# Altium schematic sheet Sheet.schdoc
size 307 x 221 mm
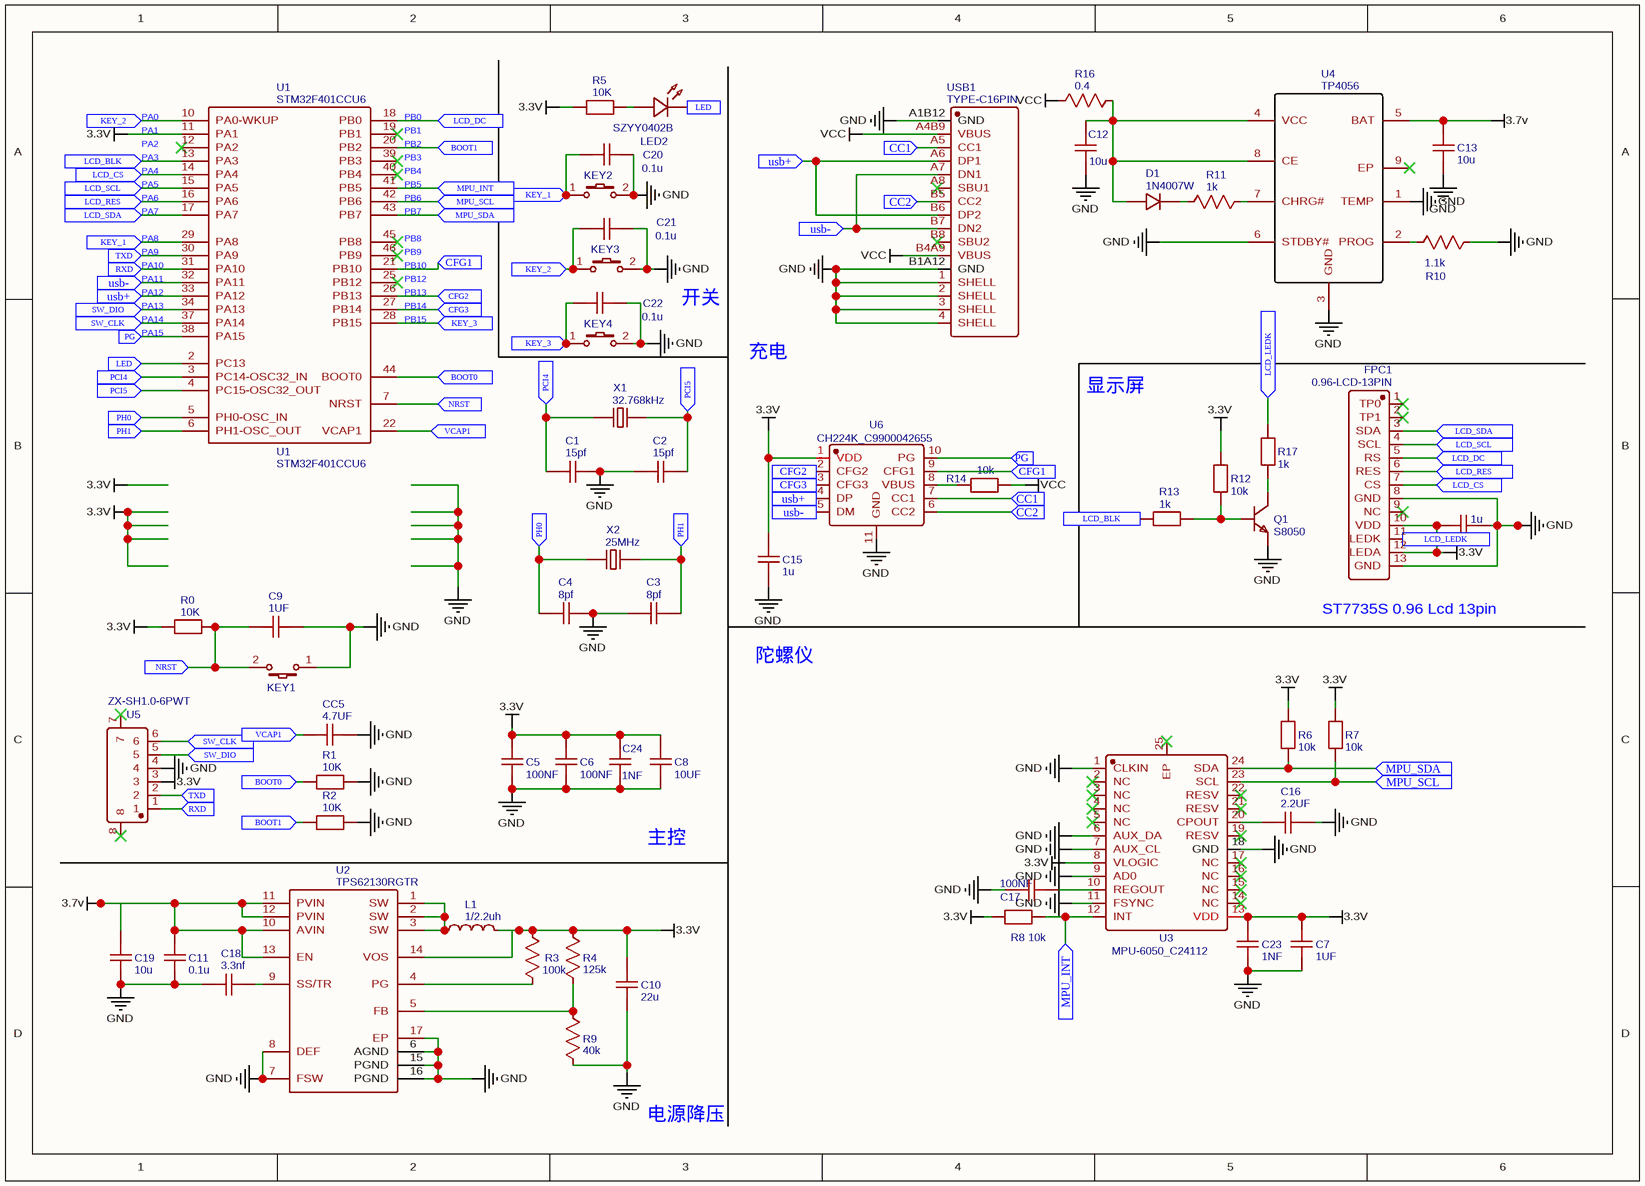
[diagram p0: Sheet.schdoc]

## Parts
(Parts that share a designator on the sheet are numbered #1, #2 ... from top to bottom, then left to right.)
C1  15pf  [C0402]
C2  15pf  [C0402]
C3  8pf  [C0402]
C4  8pf  [C0402]
C5  100NF  [C0402]
C6  100NF  [C0402]
C7  1UF  [C0402]
C8  10UF  [C0402]
C9  1UF  [C0402]
C10  22u  [C0402]
C11  0.1u  [C0402]
C12  10u  [C0402]
C13  10u  [C0402]
C14  1u  [C0402]
C15  1u  [C0402]
C16  2.2UF  [C0603]
C17  100NF  [C0603]
C18  3.3nf  [C0402]
C19  10u  [C0402]
C20  0.1u  [C0603]
C21  0.1u  [C0603]
C22  0.1u  [C0603]
C23  1NF  [C0603]
C24  1NF  [C0603]
CC5  4.7UF  [C0603]
D1  1N4007W  [SOD-123_L2.8-W1.8-LS3.7-RD]
FPC1  0.96-LCD-13PIN  [0.96LCD-13PIN]
KEY1  K2-3.6×6.1_SMD  [KEY-SMD_2P-L6.2-W3.6-LS8.0]  (value not drawn)
KEY2  K2-3.6×6.1_SMD  [KEY-SMD_2P-L6.2-W3.6-LS8.0]  (value not drawn)
KEY3  K2-3.6×6.1_SMD  [KEY-SMD_2P-L6.2-W3.6-LS8.0]  (value not drawn)
KEY4  K2-3.6×6.1_SMD  [KEY-SMD_2P-L6.2-W3.6-LS8.0]  (value not drawn)
L1  1/2.2uh  [L0603]
LED2  SZYY0402B  [LED0402-RD_BLUE]
Q1  S8050  [SOT-23-3_L2.9-W1.3-P1.90-LS2.4-TR]
R0  10K  [R0402]
R1  10K  [R0402]
R2  10K  [R0402]
R3  100k  [R0603]
R4  125k  [R0603]
R5  10K  [R0402]
R6  10k  [R0402]
R7  10k  [R0402]
R8  10k  [R0402]
R9  40k  [R0603]
R10  1.1k  [R0603]
R11  1k  [R0603]
R12  10k  [R0402]
R13  1k  [R0402]
R14  10k  [R0603]
R16  0.4  [R0603]
R17  1k  [R0603]
U1#1  STM32F401CCU6  [UFQFPN-48_L7.0-W7.0-P0.50-BL-EP]
U1#2  STM32F401CCU6  [UFQFPN-48_L7.0-W7.0-P0.50-BL-EP]
U2  TPS62130RGTR  [QFN-16_L3.0-W3.0-P0.50-TL-EP1.7]
U3  MPU-6050_C24112  [QFN-24_L4.0-W4.0-P0.50-BL-EP2.7]
U4  TP4056  [ESOP-8_L4.9-W3.9-P1.27-LS6.0-BL-EP]
U5  ZX-SH1.0-6PWT  [CONN-SMD_6P-P1.00_MEGASTAR_ZX-SH1.0-6PWT]
U6  CH224K_C9900042655  [ESSOP-10_L4.9-W3.9-P1.00-LS6.0-BL-EP]
USB1  TYPE-C16PIN  [USB-C-SMD_TYPE-C16PIN]
X1  32.768kHz  [OSC-SMD_L3.2-W1.5]
X2  25MHz  [OSC-SMD_L3.2-W1.5]

## Ports
BOOT0 (in), BOOT1 (in), CC1 (in), CC2 (in), CFG1 (in), CFG2 (in), CFG3 (in), KEY_1 (in), KEY_2 (in), KEY_3 (in), LCD_BLK (in), LCD_CS (in), LCD_DC (in), LCD_LEDK (in), LCD_RES (in), LCD_SCL (in), LCD_SDA (in), LED (in), MPU_INT (in), MPU_SCL (in), MPU_SDA (in), NRST (in), PCI4 (in), PCI5 (in), PG (in), PH0 (in), PH1 (in), RXD (in), SW_CLK (in), SW_DIO (in), TXD (in), usb+ (in), usb- (in), VCAP1 (in)

## Nets
3.3V: C5.1 C6.1 C7.1 C8.1 C10.1 C14.1 C15.2 C23.2 C24.2 FPC1.10(VDD) FPC1.12(LEDA) L1.2 R0.1 R3.1 R4.2 R5.1 R6.1 R7.1 R8.1 R12.2 U1#1.11(PA1) U2.14(VOS) U3.8(VLOGIC) U3.13(VDD) U5.3 U6.1(VDD)
3.7v: C11.1 C13.2 C19.1 U2.10(AVIN) U2.11(PVIN) U2.12(PVIN) U2.13(EN) U4.5(BAT)
GND: C1.2 C2.1 C3.1 C4.2 C5.2 C6.2 C7.2 C8.2 C9.2 C10.2 C11.2 C12.1 C13.1 C14.2 C15.1 C16.2 C17.1 C18.1 C19.2 C20.2 C21.2 C22.2 C23.1 C24.1 CC5.2 FPC1.8(GND) FPC1.13(GND) KEY1.1 KEY2.2 KEY3.2 KEY4.2 Q1.1(E) R1.2 R2.2 R9.1 R10.2 U2.6(AGND) U2.7(FSW) U2.8(DEF) U2.15(PGND) U2.16(PGND) U2.17(EP) U3.1(CLKIN) U3.6(AUX_DA) U3.7(AUX_CL) U3.9(AD0) U3.11(FSYNC) U3.18(GND) U4.1(TEMP) U4.3(GND) U4.6(STDBY#) U5.4 U6.11(GND) USB1.1(SHELL) USB1.2(SHELL) USB1.3(SHELL) USB1.4(SHELL) USB1.A1B12(GND) USB1.B1A12(GND)
VCC: R14.2 R16.1 USB1.A4B9(VBUS) USB1.B4A9(VBUS)
BOOT0: R1.1 U1#1.44(BOOT0) ; port BOOT0
BOOT1: R2.1 U1#1.20(PB2) ; port BOOT1
CC1: U6.7(CC1) USB1.A5(CC1) ; port CC1
CC2: U6.6(CC2) USB1.B5(CC2) ; port CC2
CFG1: U1#1.21(PB10) U6.9(CFG1) ; port CFG1
CFG2: U1#1.26(PB13) U6.2(CFG2) ; port CFG2
CFG3: U1#1.27(PB14) U6.3(CFG3) ; port CFG3
KEY_1: C20.1 KEY2.1 U1#1.29(PA8) ; port KEY_1
KEY_2: C21.1 KEY3.1 U1#1.10(PA0-WKUP) ; port KEY_2
KEY_3: C22.1 KEY4.1 U1#1.28(PB15) ; port KEY_3
LCD_BLK: R13.1 U1#1.13(PA3) ; port LCD_BLK
LCD_CS: FPC1.7(CS) U1#1.14(PA4) ; port LCD_CS
LCD_DC: FPC1.5(RS) U1#1.18(PB0) ; port LCD_DC
LCD_LEDK: FPC1.11(LEDK) R17.2 ; port LCD_LEDK
LCD_RES: FPC1.6(RES) U1#1.16(PA6) ; port LCD_RES
LCD_SCL: FPC1.4(SCL) U1#1.15(PA5) ; port LCD_SCL
LCD_SDA: FPC1.3(SDA) U1#1.17(PA7) ; port LCD_SDA
LED: LED2.1(K) U1#1.2(PC13) ; port LED
MPU_INT: R8.2 U1#1.41(PB5) U3.12(INT) ; port MPU_INT
MPU_SCL: R7.2 U1#1.42(PB6) U3.23(SCL) ; port MPU_SCL
MPU_SDA: R6.2 U1#1.43(PB7) U3.24(SDA) ; port MPU_SDA
NRST: C9.1 KEY1.2 R0.2 U1#1.7(NRST) ; port NRST
PCI4: C1.1 U1#1.3(PC14-OSC32_IN) X1.1 ; port PCI4
PCI5: C2.2 U1#1.4(PC15-OSC32_OUT) X1.2 ; port PCI5
PG: U1#1.38(PA15) U6.10(PG) ; port PG
PH0: C4.1 U1#1.5(PH0-OSC_IN) X2.1 ; port PH0
PH1: C3.2 U1#1.6(PH1-OSC_OUT) X2.2 ; port PH1
RXD: U1#1.31(PA10) U5.1 ; port RXD
SW_CLK: U1#1.37(PA14) U5.6 ; port SW_CLK
SW_DIO: U1#1.34(PA13) U5.5 ; port SW_DIO
TXD: U1#1.30(PA9) U5.2 ; port TXD
usb+: U1#1.33(PA12) U6.4(DP) USB1.A6(DP1) USB1.B6(DP2) ; port usb+
usb-: U1#1.32(PA11) U6.5(DM) USB1.A7(DN1) USB1.B7(DN2) ; port usb-
VCAP1: CC5.1 U1#1.22(VCAP1) ; port VCAP1
NetC12_2: C12.2 D1.2 R16.2 U4.4(VCC) U4.8(CE)
NetC16_1: C16.1 U3.20(CPOUT)
NetC17_2: C17.2 U3.10(REGOUT)
NetC18_2: C18.2 U2.9(SS/TR)
NetD1_1: D1.1 R11.1
NetL1_1: L1.1 U2.1(SW) U2.2(SW) U2.3(SW)
NetLED2_2: LED2.2(A) R5.2
NetQ1_2: Q1.2(B) R12.1 R13.2
NetQ1_3: Q1.3(C) R17.1
NetR3_2: R3.2 U2.4(PG)
NetR4_1: R4.1 R9.2 U2.5(FB)
NetR10_1: R10.1 U4.2(PROG)
NetR11_2: R11.2 U4.7(CHRG#)
NetR14_1: R14.1 U6.8(VBUS)

Not connected (* = marked no-connect by the designer): FPC1 1(TP0)* 2(TP1)* 9(NC)*; U1#1 12(PA2)* 19(PB1)* 25(PB12)* 39(PB3)* 40(PB4)* 45(PB8)* 46(PB9)*; U3 2(NC)* 3(NC)* 4(NC)* 5(NC)* 14(NC)* 15(NC)* 16(NC)* 17(NC)* 19(RESV)* 21(RESV)* 22(RESV)* 25(EP)*; U4 9(EP)*; U5 7* 8*; USB1 A8(SBU1)* B8(SBU2)*

## Notes on the sheet
- PA0
- (near U1#1) PB0
- PA1
- PA2
- PA4
- PA5
- PA3
- (near U1#1) PB1
- (near U1#1) PB2
- (near U1#1) PB3
- (near U1#1) PB4
- (near U1#1) PB5
- PA6
- PA7
- PA8
- PA9
- (near U1#1) PB6
- (near U1#1) PB7
- (near U1#1) PB8
- (near U1#1) PB9
- (near U1#1) PA10
- (near U1#1) PA11
- (near U1#1) PA12
- (near U1#1) PA13
- (near U1#1) PA14
- (near U1#1) PB10
- (near U1#1) PB12
- (near U1#1) PB13
- (near U1#1) PB14
- (near U1#1) PB15
- 开关
- (near U1#1) PA15
- 充电
- 显示屏
- 陀螺仪
- (near FPC1) ST7735S 0.96 Lcd 13pin
- 主控
- 电源降压

## Library data of the parts
C1 C2 = 15pf: nameAlias: Value(F); Contributor: LCEDA_Lib; spicePre: C; spiceSymbolName: C_0402_US
C3 C4 = 8pf: nameAlias: Value(F); Contributor: LCEDA_Lib; spicePre: C; spiceSymbolName: C_0402_US
C5 C6 C17 = 100NF: nameAlias: Value(F); Contributor: LCEDA_Lib; spicePre: C
  C5 C6: spiceSymbolName: C_0402_US
  C17: spiceSymbolName: C_0603_US
C7 C9 = 1UF: nameAlias: Value(F); Contributor: LCEDA_Lib; spicePre: C; spiceSymbolName: C_0402_US
C8 = 10UF: nameAlias: Value(F); Contributor: LCEDA_Lib; spicePre: C; spiceSymbolName: C_0402_US
C10 = 22u: nameAlias: Value(F); Contributor: LCEDA_Lib; spicePre: C; spiceSymbolName: C_0402_US
C11 C20-C22 = 0.1u: nameAlias: Value(F); Contributor: LCEDA_Lib; spicePre: C
  C11: spiceSymbolName: C_0402_US
  C20-C22: spiceSymbolName: C_0603_US
C12 C13 C19 = 10u: nameAlias: Value(F); Contributor: LCEDA_Lib; spicePre: C; spiceSymbolName: C_0402_US
C14 C15 = 1u: nameAlias: Value(F); Contributor: LCEDA_Lib; spicePre: C; spiceSymbolName: C_0402_US
C16 = 2.2UF: nameAlias: Value(F); Contributor: LCEDA_Lib; spicePre: C; spiceSymbolName: C_0603_US
C18 = 3.3nf: nameAlias: Value(F); Contributor: LCEDA_Lib; spicePre: C; spiceSymbolName: C_0402_US
C23 C24 = 1NF: nameAlias: Value(F); Contributor: LCEDA_Lib; spicePre: C; spiceSymbolName: C_0603_US
CC5 = 4.7UF: nameAlias: Value(F); Contributor: LCEDA_Lib; Package Display: No; spicePre: C; spiceSymbolName: C_0603_US
D1 = 1N4007W: Manufacturer: BLUE ROCKET; Contributor: LCEDA_Lib; Supplier: LCSC; Supplier Part: C328592; Manufacturer Part: 1N4007W; spicePre: D; spiceSymbolName: 1N4007W
FPC1 = 0.96-LCD-13PIN: Manufacturer: kinghelm(金航标); Contributor: yanwudi; Supplier: LCSC; Supplier Part: C2932719; Manufacturer Part: 0.96-LCD-13PIN; spicePre: F; spiceSymbolName: 0.96-LCD-13PIN
KEY1-KEY4 = K2-3.6×6.1_SMD: Manufacturer Part: K2-1107ST-A4SW-06; Contributor: LCEDA_Lib; 制造商: 韩国韩荣; Supplier Part: C118141; Supplier: LCSC; spicePre: K; spiceSymbolName: K2-3.6×6.1_SMD
L1 = 1/2.2uh: nameAlias: Value(H); Contributor: LCEDA_Lib; spicePre: L; spiceSymbolName: L0603_US
LED2 = SZYY0402B: Manufacturer: yongyu(永裕光电); Contributor: LCSC; Supplier: LCSC; Supplier Part: C434447; JLCPCB Part Class: Extended Part; spicePre: L; spiceSymbolName: SZYY0402B
Q1 = S8050: Manufacturer: KEC; Manufacturer Part: 2n3904S-RTK/PS; Paste Type: SOT-23; Contributor: LCEDA_Lib; Supplier: LCSC; Supplier Part: C18536; spicePre: Q; spiceSymbolName: 2N3904(SOT-23)
R0-R2 R5 = 10K: nameAlias: Value(Ω); Contributor: LCEDA_Lib; spicePre: R; spiceSymbolName: R_0402_EU
R3 = 100k: nameAlias: Value(Ω); Contributor: LCEDA_Lib; spicePre: R; spiceSymbolName: R_0603_US
R4 = 125k: nameAlias: Value(Ω); Contributor: LCEDA_Lib; spicePre: R; spiceSymbolName: R_0603_US
R6-R8 R12 R14 = 10k: nameAlias: Value(Ω); Contributor: LCEDA_Lib; spicePre: R
  R6-R8 R12: spiceSymbolName: R_0402_EU
  R14: spiceSymbolName: R_0603_EU
R9 = 40k: nameAlias: Value(Ω); Contributor: LCEDA_Lib; spicePre: R; spiceSymbolName: R_0603_US
R10 = 1.1k: nameAlias: Value(Ω); Contributor: LCEDA_Lib; spicePre: R; spiceSymbolName: R_0603_US
R11 R13 R17 = 1k: nameAlias: Value(Ω); Contributor: LCEDA_Lib; spicePre: R
  R11: spiceSymbolName: R_0603_US
  R13: spiceSymbolName: R_0402_EU
  R17: spiceSymbolName: R_0603_EU
R16 = 0.4: nameAlias: Value(Ω); Contributor: LCEDA_Lib; spicePre: R; spiceSymbolName: R_0603_US
U1#1 U1#2 = STM32F401CCU6: subpart_no: 1; Manufacturer: ST(意法半导体); tags: STM32; Supplier Part: C79861; Supplier: LCSC; JLCPCB Part Class: Extended Part; spicePre: U; spiceSymbolName: STM32F401CCU6
U2 = TPS62130RGTR: Manufacturer: TI(德州仪器); Supplier: LCSC; Supplier Part: C43590; JLCPCB Part Class: Extended Part; spicePre: U; spiceSymbolName: TPS62130RGTR
U3 = MPU-6050_C24112: Manufacturer: TDK InvenSense(应美盛); sourceId: 1T5FDZYC8; timeStamp: 1462265206; Supplier: LCSC; Supplier Part: C24112; JLCPCB Part Class: Basic Part; spicePre: U; spiceSymbolName: MPU-6050_C24112
U4 = TP4056: Manufacturer: TOPPOWER(南京拓微); Contributor: Guest; Supplier: LCSC; Supplier Part: C16581; JLCPCB Part Class: Basic Part; spicePre: U; spiceSymbolName: TP4056
U5 = ZX-SH1.0-6PWT: Manufacturer: Megastar(兆星); Contributor: lcsc; Supplier: LCSC; Supplier Part: C7430448; JLCPCB Part Class: Extended Part; spicePre: U; spiceSymbolName: ZX-SH1.0-6PWT
U6 = CH224K_C9900042655: Manufacturer: null; Contributor: lcsc; Supplier: LCSC; Supplier Part: C9900042655; spicePre: U; spiceSymbolName: CH224K_C9900042655
USB1 = TYPE-C16PIN: Manufacturer: SHOU HAN(首韩); Contributor: LCSC; Supplier: LCSC; Supplier Part: C393939; JLCPCB Part Class: Extended Part; spicePre: U; spiceSymbolName: TYPE-C16PIN
X1 = 32.768kHz: Manufacturer: YXC(扬兴晶振); nameAlias: Value; Contributor: LCSC; Supplier: LCSC; Supplier Part: C620155; JLCPCB Part Class: Extended Part; spicePre: X; spiceSymbolName: X321532768KGD2SI
X2 = 25MHz: Manufacturer: YXC(扬兴晶振); nameAlias: Value; Contributor: LCSC; Supplier: LCSC; Supplier Part: C620155; JLCPCB Part Class: Extended Part; spicePre: X; spiceSymbolName: X321532768KGD2SI